# EAGLE design ExpBoard1 (EAGLE 6.4)
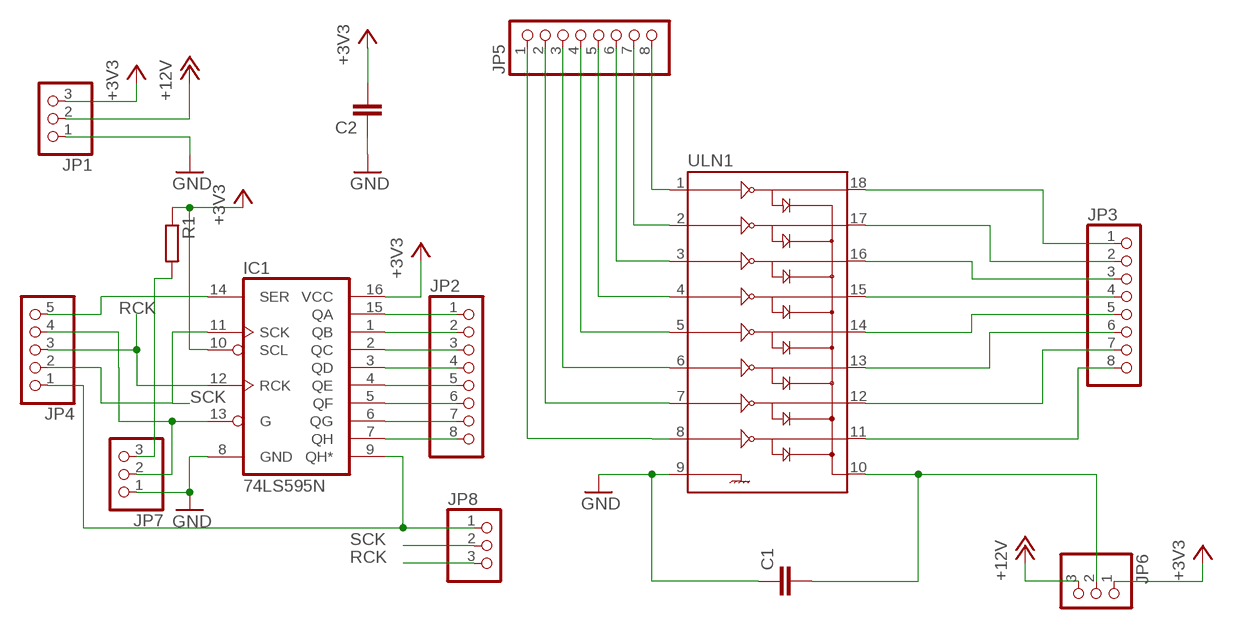
[diagram p0: schematic, sheet 1]

## Parts
C1  C-EU050-024X044  [C050-024X044]
C2  C-EU025-024X044  [C025-024X044]
IC1  74LS595N  [DIL16]
JP1  PINHD-1X3  [1X03]
JP2  PINHD-1X8  [1X08]
JP3  PINHD-1X8  [1X08]
JP4  PINHD-1X5  [1X05]
JP5  PINHD-1X8  [1X08]
JP6  PINHD-1X3  [1X03]
JP7  PINHD-1X3  [1X03]
JP8  PINHD-1X3  [1X03]
R1  R-EU_0207/12  [0207/12]
ULN1  ULN2803DIP  [DIL18]

## Nets
+3V3: C2.2 IC1.10(SCL) IC1.16(VCC) JP1.3 JP6.1 R1.1
+12V: JP1.2 JP6.3
GND: C1.1 C2.1 IC1.8(GND) JP1.1 JP7.1 ULN1.9
N$1: IC1.14(SER) JP4.5
N$2: C1.2 JP6.2 ULN1.10
N$5: JP3.1 ULN1.18
N$6: JP3.2 ULN1.17
N$7: JP3.3 ULN1.16
N$8: JP3.4 ULN1.15
N$9: JP3.5 ULN1.14
N$10: JP3.6 ULN1.13
N$11: JP3.7 ULN1.12
N$12: JP3.8 ULN1.11
N$13: JP5.8 ULN1.1
N$14: JP5.7 ULN1.2
N$15: JP5.6 ULN1.3
N$16: JP5.5 ULN1.4
N$17: JP5.4 ULN1.5
N$18: JP5.3 ULN1.6
N$19: JP5.2 ULN1.7
N$20: JP5.1 ULN1.8
N$21: IC1.15(QA) JP2.1
N$22: IC1.1(QB) JP2.2
N$23: IC1.2(QC) JP2.3
N$24: IC1.3(QD) JP2.4
N$25: IC1.4(QE) JP2.5
N$26: IC1.5(QF) JP2.6
N$27: IC1.6(QG) JP2.7
N$28: IC1.7(QH) JP2.8
N$29: IC1.13(G) JP4.4 JP7.2
N$31: IC1.9(QH*) JP4.1 JP8.1
N$32: JP7.3 R1.2
RCK: IC1.12(RCK) JP4.3 JP8.3
SCK: IC1.11(SCK) JP4.2 JP8.2

## Library data of the parts
C1 C2 = rcl:C-EU: CAPACITOR, European symbol
IC1 = SparkFun:74*595: 8-bit SHIFT REGISTER, output latch
JP1 JP6-JP8 = pinhead:PINHD-1X3: PIN HEADER
JP2 JP3 JP5 = pinhead:PINHD-1X8: PIN HEADER
JP4 = pinhead:PINHD-1X5: PIN HEADER
R1 = rcl:R-EU_: RESISTOR, European symbol
ULN1 = SparkFun:ULN2803: Darlington Driver ULN2803 Darlington array. 500mA max per channel, 8-channel package. Spark Fun Electronics SKU : COM-00312

## Board
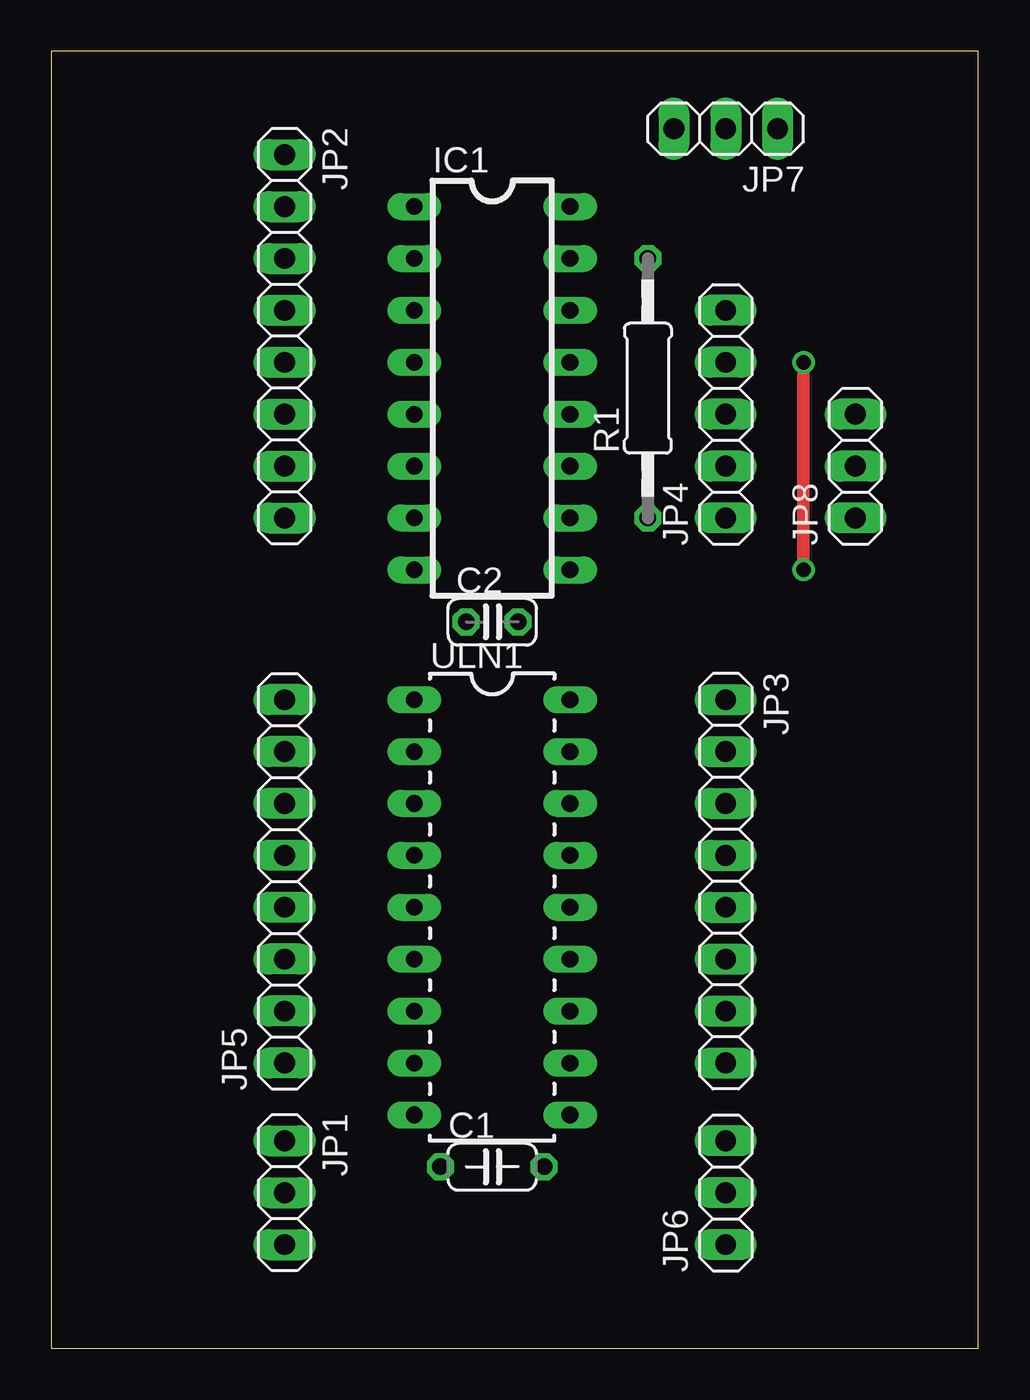
[diagram p1: board, top side]
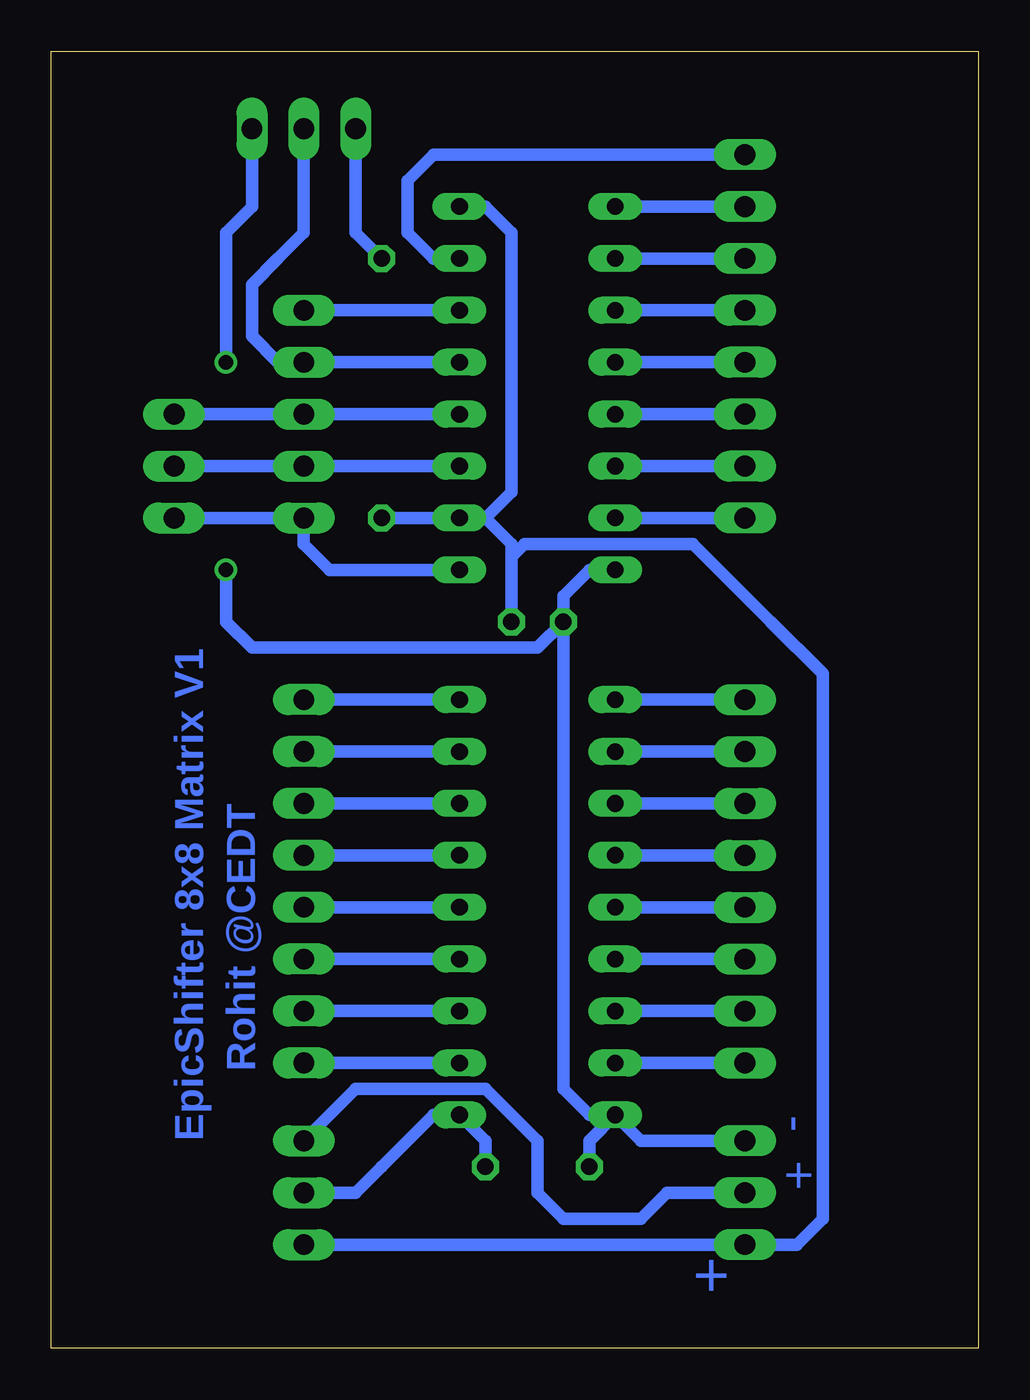
[diagram p2: board, bottom side, seen from below]

Size 45.39 x 63.49 mm. Coordinates in mm from the lower left corner, seen from the top.
Outline: 0,0 45.39,0 45.39,63.49 0,63.49 0,0
Copper layers (1*16): Top 0.035mm / dielectric 1.5mm / Bottom 0.035mm
Design rules "default": minimum track width 10mil, minimum drill 24mil, track to track 8mil, track to pad 8mil, pad to pad 8mil, via to via 8mil, smd to smd 8mil, copper to edge 40mil, drill to drill 8mil, minimum pad ring 10mil, minimum via ring 8mil, stop-mask expansion 4mil, vias tented up to drill 0mil, thermal gap 10mil

### Footprints (pad centres in the part's own frame; a part is rotated, then mirrored left to right if it is on the bottom)
C050-024X044 = drill 0.813 octagon: 1 -2.54,0; 2 2.54,0
C025-024X044 = drill 0.813 octagon: 1 -1.27,0; 2 1.27,0
DIL16 = drill 0.813 long: 1 -8.89,-3.81; 2 -6.35,-3.81; 3 -3.81,-3.81; 4 -1.27,-3.81; 5 1.27,-3.81; 6 3.81,-3.81; 7 6.35,-3.81; 8 8.89,-3.81; 9 8.89,3.81; 10 6.35,3.81; 11 3.81,3.81; 12 1.27,3.81; 13 -1.27,3.81; 14 -3.81,3.81; 15 -6.35,3.81; 16 -8.89,3.81
1X03 = drill 1.016 long: 1 -2.54,0; 2 0,0; 3 2.54,0
1X08 = drill 1.016 long: 1 -8.89,0; 2 -6.35,0; 3 -3.81,0; 4 -1.27,0; 5 1.27,0; 6 3.81,0; 7 6.35,0; 8 8.89,0
1X05 = drill 1.016 long: 1 -5.08,0; 2 -2.54,0; 3 0,0; 4 2.54,0; 5 5.08,0
0207/12 = drill 0.813 octagon: 1 -6.35,0; 2 6.35,0
DIL18 = drill 0.813 long: 1 -10.16,-3.81; 2 -7.62,-3.81; 3 -5.08,-3.81; 4 -2.54,-3.81; 5 0,-3.81; 6 2.54,-3.81; 7 5.08,-3.81; 8 7.62,-3.81; 9 10.16,-3.81; 10 10.16,3.81; 11 7.62,3.81; 12 5.08,3.81; 13 2.54,3.81; 14 0,3.81; 15 -2.54,3.81; 16 -5.08,3.81; 17 -7.62,3.81; 18 -10.16,3.81

### Placement (x,y rotation side)
C1  21.59,8.89 0 top
C2  21.59,35.56 0 top
IC1  21.59,46.99 270 top
JP1  11.43,7.62 270 top
JP2  11.43,49.53 270 top
JP3  33.02,22.86 270 top
JP4  33.02,45.72 90 top
JP5  11.43,22.86 90 top
JP6  33.02,7.62 90 top
JP7  33.02,59.69 180 top
JP8  39.37,43.18 90 top
R1  29.21,46.99 90 top
ULN1  21.59,21.59 270 top

### Tracks (layer width: path | path; a pad name or v marks a point on that pad's centre or on a via)
+3V3
  Bottom 0.61: IC1.10 R1.1 | JP1.3 JP6.1 | JP6.1 JP1.3 | IC1.16 24.13,55.88 22.86,54.61 22.86,41.91 24.13,40.64 | IC1.10 24.13,40.64 | 24.13,40.64 22.86,39.37 22.86,38.73 | 22.86,38.73 C2.2 | IC1.10 24.13,40.64 | JP6.1 JP1.3 | JP1.3 8.89,5.08 7.62,6.35 7.62,33.02 10.16,35.56 13.97,39.37 22.23,39.37 22.86,38.73
+12V
  Bottom 0.61: JP1.2 15.24,7.62 16.51,6.35 20.32,6.35 21.59,7.62 21.59,10.16 24.13,12.7 30.48,12.7 JP6.3
GND  (via drill 0.7, 0.7 pad 1.02)
  Top 0.61: v36.83,48.26 v36.83,38.1
  Bottom 0.61: IC1.8 19.05,38.1 20.32,36.83 C2.1 | JP1.1 16.51,10.16 ULN1.9 | C1.1 19.05,10.16 ULN1.9 | ULN1.9 19.05,11.43 20.32,12.7 C2.1 | JP7.1 35.56,55.88 36.83,54.61 v36.83,48.26 | v36.83,38.1 36.83,35.56 35.56,34.29 21.59,34.29 C2.1
N$1
  Bottom 0.61: IC1.14 JP4.5
N$2
  Bottom 0.61: JP6.2 30.48,7.62 29.21,8.89 26.67,11.43 ULN1.10 24.13,10.16 C1.2
N$5
  Bottom 0.61: ULN1.18 JP3.1
N$6
  Bottom 0.61: ULN1.17 JP3.2
N$7
  Bottom 0.61: ULN1.16 JP3.3
N$8
  Bottom 0.61: ULN1.15 JP3.4
N$9
  Bottom 0.61: ULN1.14 JP3.5
N$10
  Bottom 0.61: ULN1.13 JP3.6
N$11
  Bottom 0.61: ULN1.12 31.75,16.51 JP3.7
N$12
  Bottom 0.61: ULN1.11 JP3.8
N$13
  Bottom 0.61: ULN1.1 JP5.8
N$14
  Bottom 0.61: ULN1.2 12.7,29.21 JP5.7
N$15
  Bottom 0.61: JP5.6 16.51,26.67 ULN1.3
N$16
  Bottom 0.61: JP5.5 ULN1.4
N$17
  Bottom 0.61: JP5.4 ULN1.5
N$18
  Bottom 0.61: JP5.3 ULN1.6
N$19
  Bottom 0.61: JP5.2 ULN1.7
N$20
  Bottom 0.61: JP5.1 ULN1.8
N$21
  Bottom 0.61: JP2.1 26.67,58.42 27.94,57.15 27.94,54.61 26.67,53.34 IC1.15
N$22
  Bottom 0.61: JP2.2 IC1.1
N$23
  Bottom 0.61: JP2.3 IC1.2
N$24
  Bottom 0.61: JP2.4 IC1.3
N$25
  Bottom 0.61: JP2.5 IC1.4
N$26
  Bottom 0.61: JP2.6 IC1.5
N$27
  Bottom 0.61: JP2.7 IC1.6
N$28
  Bottom 0.61: JP2.8 IC1.7
N$29
  Bottom 0.61: IC1.13 JP4.4 34.29,48.26 35.56,49.53 35.56,52.07 34.29,53.34 33.02,54.61 JP7.2
N$31
  Bottom 0.61: IC1.9 31.75,38.1 33.02,39.37 JP4.1 JP8.1
N$32
  Bottom 0.61: R1.2 30.48,54.61 30.48,58.42 JP7.3
RCK
  Bottom 0.61: IC1.12 JP4.3 JP8.3
SCK
  Bottom 0.61: IC1.11 JP4.2 34.29,43.18 JP8.2

### Text on the board
Bottom: EpicShifter 8x8 Matrix V1 | Rohit @CEDT | - | + | +